# EAGLE design LED_Module (EAGLE 6.6.0)
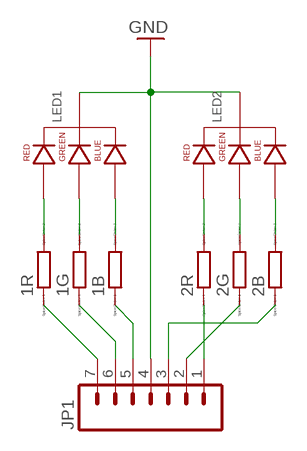
[diagram p0: schematic, sheet 1]

## Parts
1B  RR0603  [R0603]
1G  RR0603  [R0603]
1R  RR0603  [R0603]
2B  RR0603  [R0603]
2G  RR0603  [R0603]
2R  RR0603  [R0603]
JP1  M07  [1X07]
LED1  LED-RGB-CC-THRUDIFFUSE  [LED-RGB-THRU]
LED2  LED-RGB-CC-THRUDIFFUSE  [LED-RGB-THRU]

## Nets
GND: JP1.4 LED1.2(CATHODE) LED2.2(CATHODE)
N$1: 2R.2 LED2.1(RED_CATHODE)
N$2: 2G.2 LED2.3(GREEN_CATHODE)
N$3: 2B.2 LED2.4(BLUE_CATHODE)
N$4: 1R.2 LED1.1(RED_CATHODE)
N$5: 1G.2 LED1.3(GREEN_CATHODE)
N$6: 1B.2 LED1.4(BLUE_CATHODE)
N$7: 1R.1 JP1.7
N$8: 1G.1 JP1.6
N$9: 1B.1 JP1.5
N$10: 2R.1 JP1.1
N$11: 2G.1 JP1.2
N$12: 2B.1 JP1.3

## Library data of the parts
1B 1G 1R 2B 2G 2R = eagle-ltspice:R: RESISTOR, European symbol; SPICEMODEL: NONE; SPICEPREFIX: R
JP1 = SparkFun-Connectors:M07: Header 7 Standard 7-pin 0.1" header. Use with straight break away headers (SKU : PRT-00116), right angle break away headers (PRT-00553), swiss pins (PRT-00743), machine pins (PRT-00117), and female headers (PRT-00115). NOTES ON THE VARIANTS LOCK and LOCK_LONGPADS... This footprint was designed to help hold the alignment of a through-hole component (i.e. 7-pin header) while soldering it into place. You may notice that each hole has been shifted either up or down by 0.005 of an inch from it's more standard position (which is usually a perfectly straight line). This slight alteration caused the pins (the squares in the middle) to touch the edges of the holes. Because they are alternating, it causes a "brace" to hold the header in place. 0.005 has proven to be the perfect amount of "off-center" position when using our standard breakaway headers. Although looks a little odd when you look at the bare footprint, once you have a header in there, the alteration is very hard to notice. Also, if you push a header all the way into place, it is covered up entirely on the bottom side. This idea of altering the position of holes to aid alignment will be further integrated into the Sparkfun Library for other footprints. It can help hold any component with 3 or more connection pins.
LED1 LED2 = SparkFun-LED:LED-RGB-CC-THRU: RGB Through-hole common cathode LED SparkFun Storefront: COM-00105 (Clear) COM-09264 (Diffuse); PROD_ID: DIO-09434

## Board
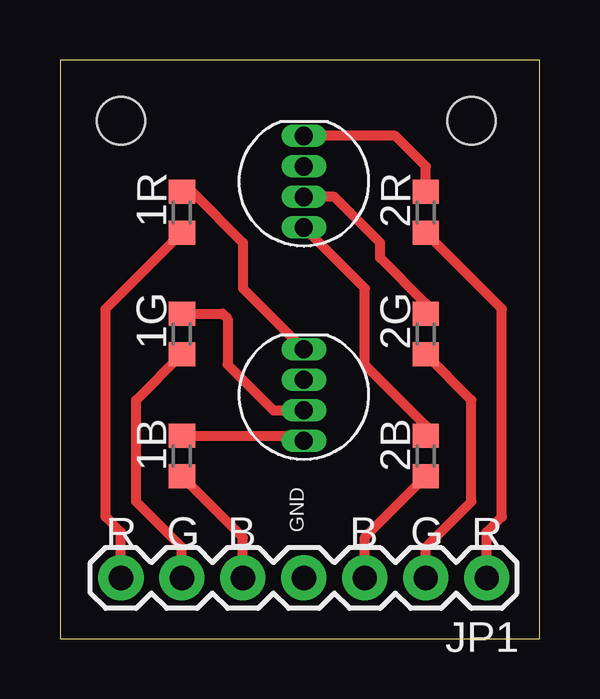
[diagram p1: board, top side]
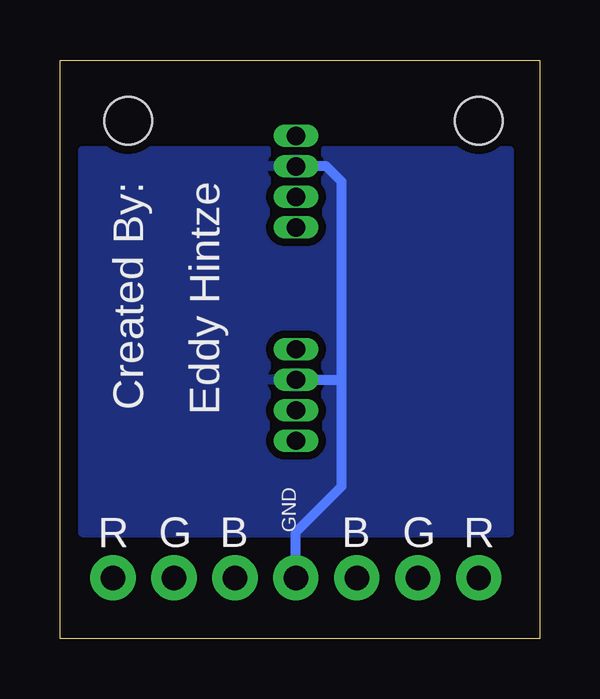
[diagram p2: board, bottom side, seen from below]

Size 19.99 x 24.12 mm. Coordinates in mm from the lower left corner, seen from the top.
Outline: 0,0 19.99,0 19.99,24.12 0,24.12 0,0
Copper layers (1*16): Top 0.0356mm / dielectric 1.5011mm / Bottom 0.0356mm
Design rules "LaenPCBOrder *": minimum track width 6mil, minimum drill 13mil, track to track 6mil, track to pad 6mil, pad to pad 6mil, via to via 6mil, smd to smd 6mil, copper to edge 15mil, drill to drill 6mil, minimum pad ring 0mil, minimum via ring 7mil, stop-mask expansion 3mil, vias tented up to drill 0mil, thermal gap 10mil
Holes 2 mm at 2.54,21.59 17.14,21.59

### Footprints (pad centres in the part's own frame; a part is rotated, then mirrored left to right if it is on the bottom)
R0603 = smd 1 x 1.1: 1 -0.85,0; 2 0.85,0
1X07 = drill 1.016 pad 1.88: 1 0,0; 2 2.54,0; 3 5.08,0; 4 7.62,0; 5 10.16,0; 6 12.7,0; 7 15.24,0
LED-RGB-THRU = drill 0.762 pad 0.889 long: 1 1.905,0; 2 0.635,0; 3 -0.635,0; 4 -1.905,0

### Placement (x,y rotation side)
1B  5.08,7.62 90 top
1G  5.08,12.7 90 top
1R  5.08,17.78 90 top
2B  15.24,7.62 90 top
2G  15.24,12.7 90 top
2R  15.24,17.78 90 top
JP1  17.78,2.54 180 top
LED1  10.16,10.16 90 top
LED2  10.16,19.05 90 top

### Tracks (layer width: path | path; a pad name or v marks a point on that pad's centre or on a via)
GND
  Bottom 0.406: JP1.4 10.16,4.45 8.26,6.35 8.26,10.79 | LED1.2 8.26,10.79 | 8.26,10.79 8.26,19.05 8.89,19.68 LED2.2
  pour Bottom (isolate 0.305): 19.05,4.45 1.27,4.45 1.27,20.32 19.05,20.32
N$1
  Top 0.406: 2R.2 15.24,19.68 13.97,20.95 LED2.1
N$2
  Top 0.406: 2G.2 15.24,13.97 13.34,15.88 13.34,16.51 11.43,18.41 LED2.3
N$3
  Top 0.406: 2B.2 15.24,8.89 12.7,11.43 12.7,14.61 LED2.4
N$4
  Top 0.406: 1R.2 5.5,18.63 7.62,16.51 7.62,14.61 LED1.1
N$5
  Top 0.406: 1G.2 6.77,13.55 6.99,13.34 6.99,11.43 8.89,9.53 LED1.3
N$6
  Top 0.406: 1B.2 9.95,8.47 LED1.4
N$7
  Top 0.406: JP1.7 2.54,4.45 1.91,5.08 1.91,13.76 1R.1
N$8
  Top 0.406: JP1.6 5.08,3.81 3.17,5.71 3.17,9.95 1G.1
N$9
  Top 0.406: JP1.5 7.62,4.23 1B.1
N$10
  Top 0.406: JP1.1 17.78,4.45 18.41,5.08 18.41,13.76 2R.1
N$11
  Top 0.406: JP1.2 15.24,3.81 17.14,5.71 17.14,9.95 2G.1
N$12
  Top 0.406: JP1.3 12.7,4.23 2B.1

### Text on the board
tPlace: R | G | B | GND | B | G | R
bPlace: Eddy Hintze | Created By: | R | G | B | GND | B | G | R